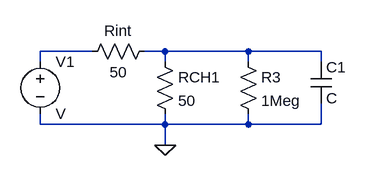
[diagram p0: schematic EsqFrecCortePuntaX1.asc]
EsqFrecCortePuntaX1.asc, the LTspice schematic file:
Version 4
SHEET 1 880 680
WIRE 32 96 -48 96
WIRE 144 96 112 96
WIRE 272 96 144 96
WIRE 384 96 272 96
WIRE -48 112 -48 96
WIRE 144 112 144 96
WIRE 272 112 272 96
WIRE 384 112 384 96
WIRE -48 208 -48 192
WIRE 144 208 144 192
WIRE 144 208 -48 208
WIRE 272 208 272 192
WIRE 272 208 144 208
WIRE 384 208 384 176
WIRE 384 208 272 208
WIRE 144 240 144 208
FLAG 144 240 0
SYMBOL res 16 112 R270
WINDOW 0 32 56 VTop 2
WINDOW 3 0 56 VBottom 2
SYMATTR InstName Rint
SYMATTR Value 50
SYMBOL res 128 96 R0
SYMATTR InstName RCH1
SYMATTR Value 50
SYMBOL res 256 96 R0
SYMATTR InstName R3
SYMATTR Value 1Meg
SYMBOL cap 368 112 R0
SYMATTR InstName C1
SYMBOL voltage -48 96 R0
SYMATTR InstName V1

The netlist it stands for:
* EsqFrecCortePuntaX1.asc
Rint N001 N002 50
RCH1 N002 0 50
R3 N002 0 1Meg
C1 N002 0 C
V1 N001 0 V
.backanno
.end